# Altium schematic sheet 8x8.SchDoc
size 513 x 571 mm
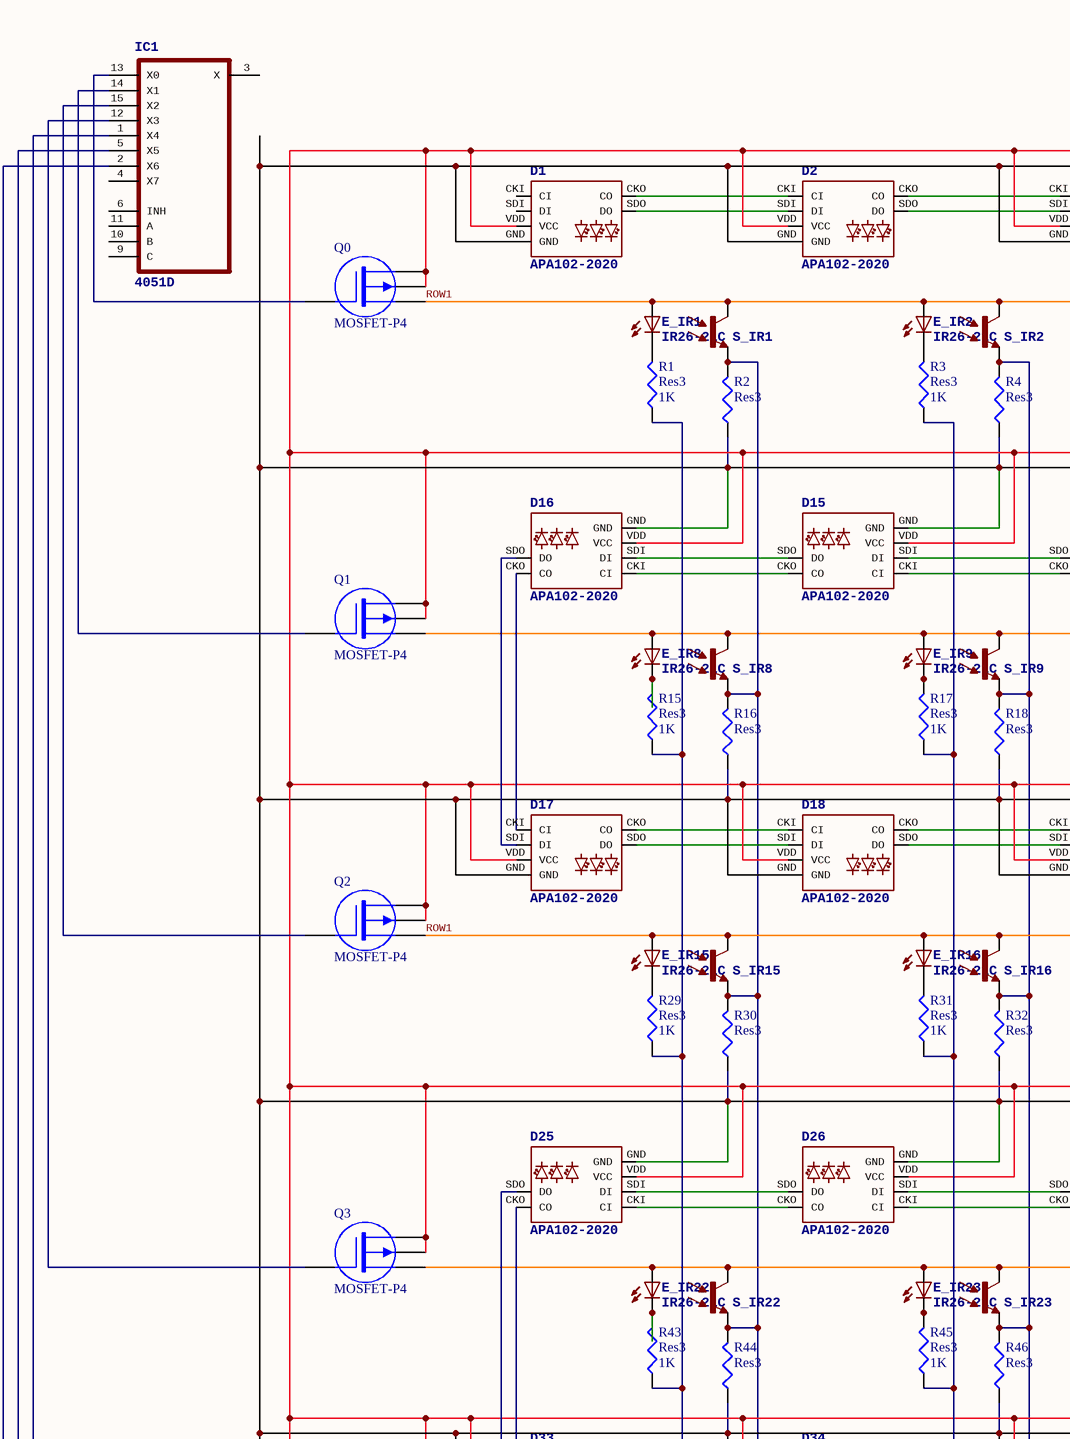
[diagram p0: 8x8.SchDoc, top left]
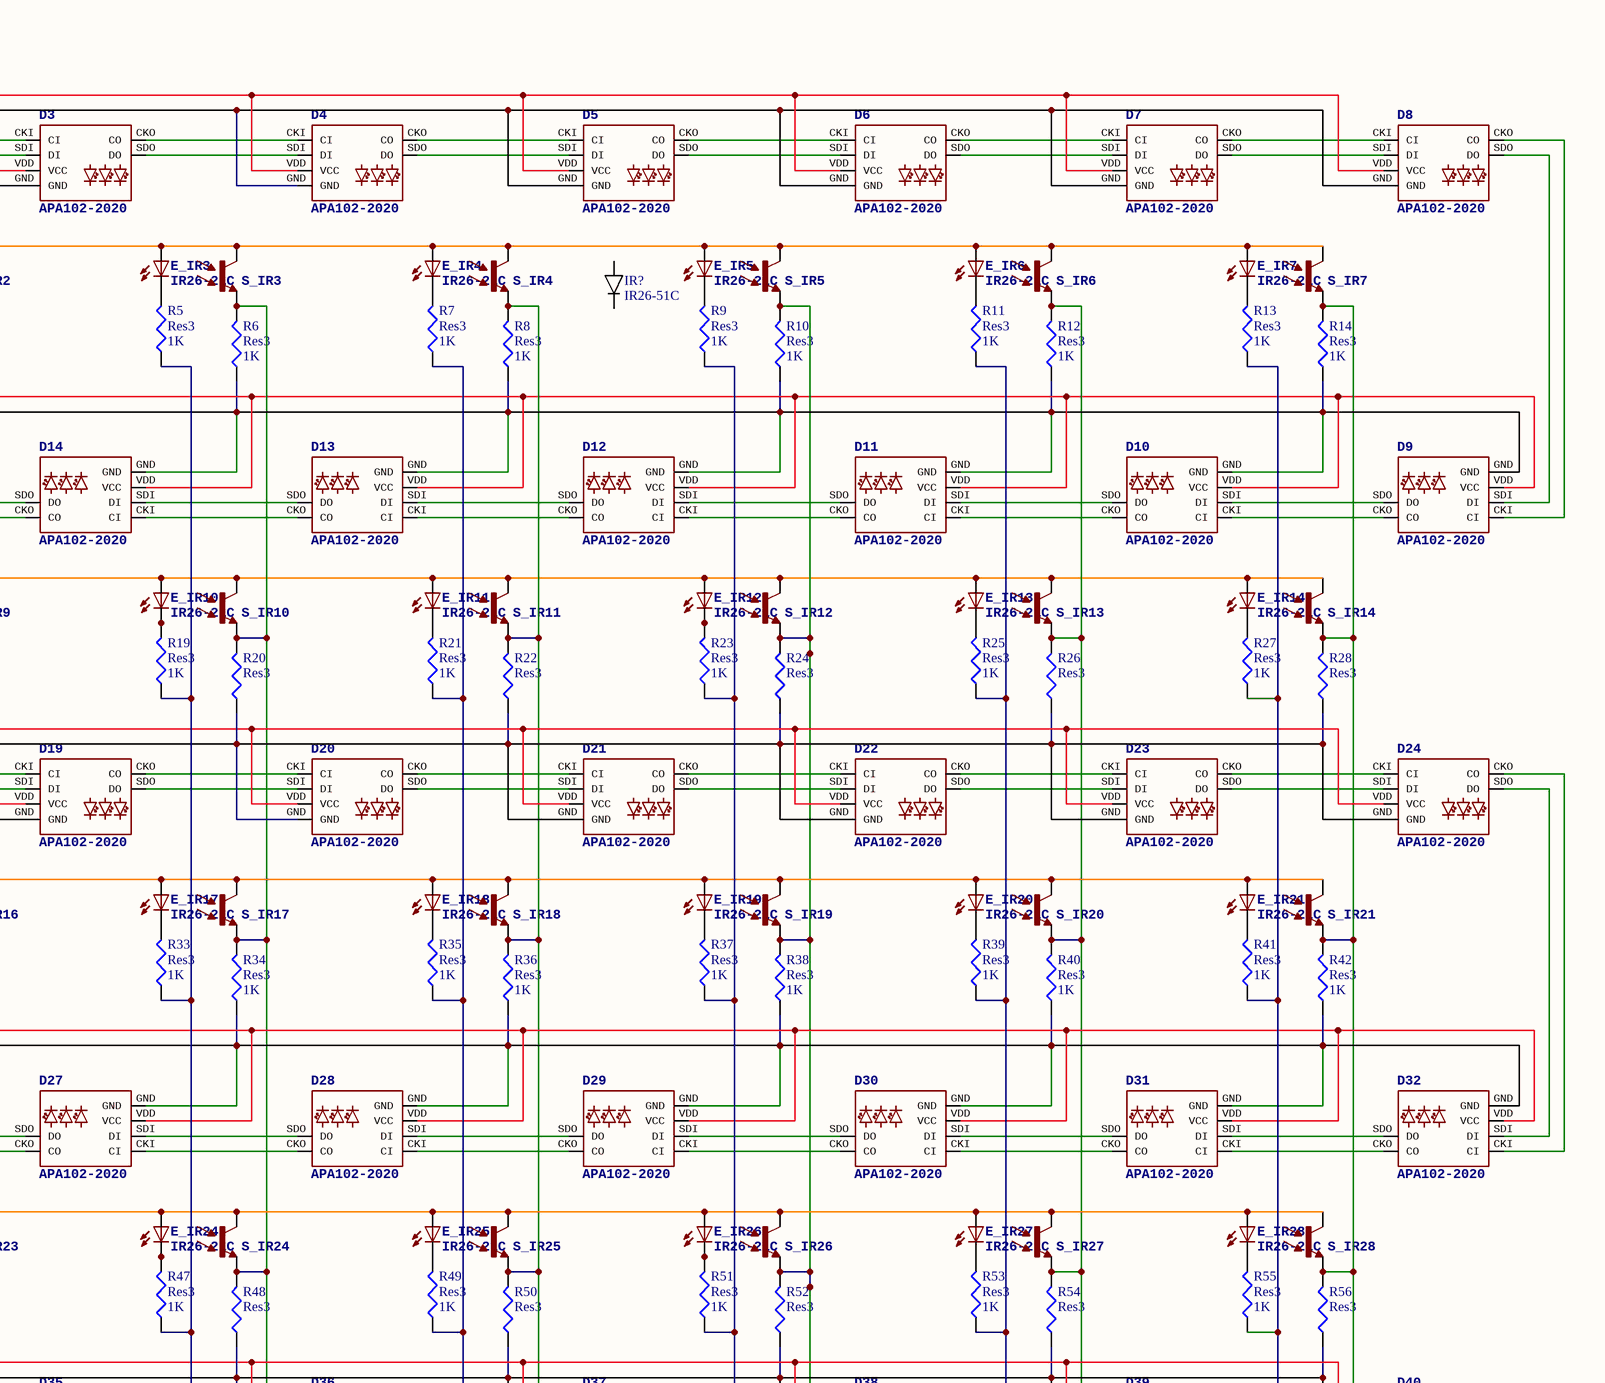
[diagram p1: 8x8.SchDoc, top right]
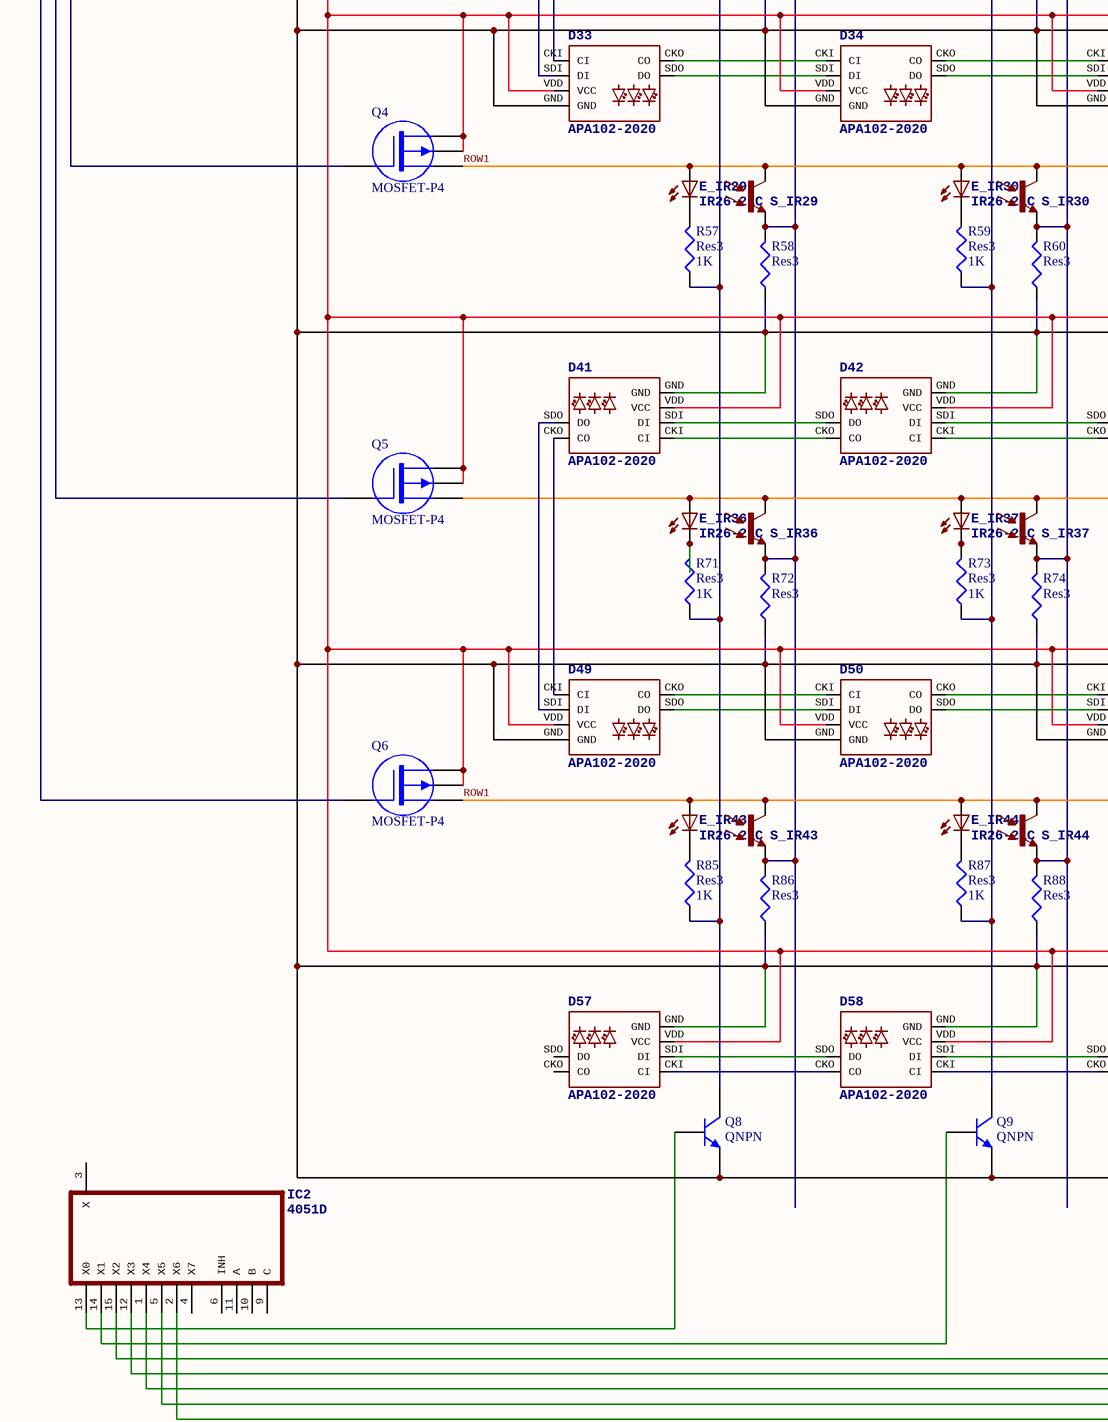
[diagram p2: 8x8.SchDoc, bottom left]
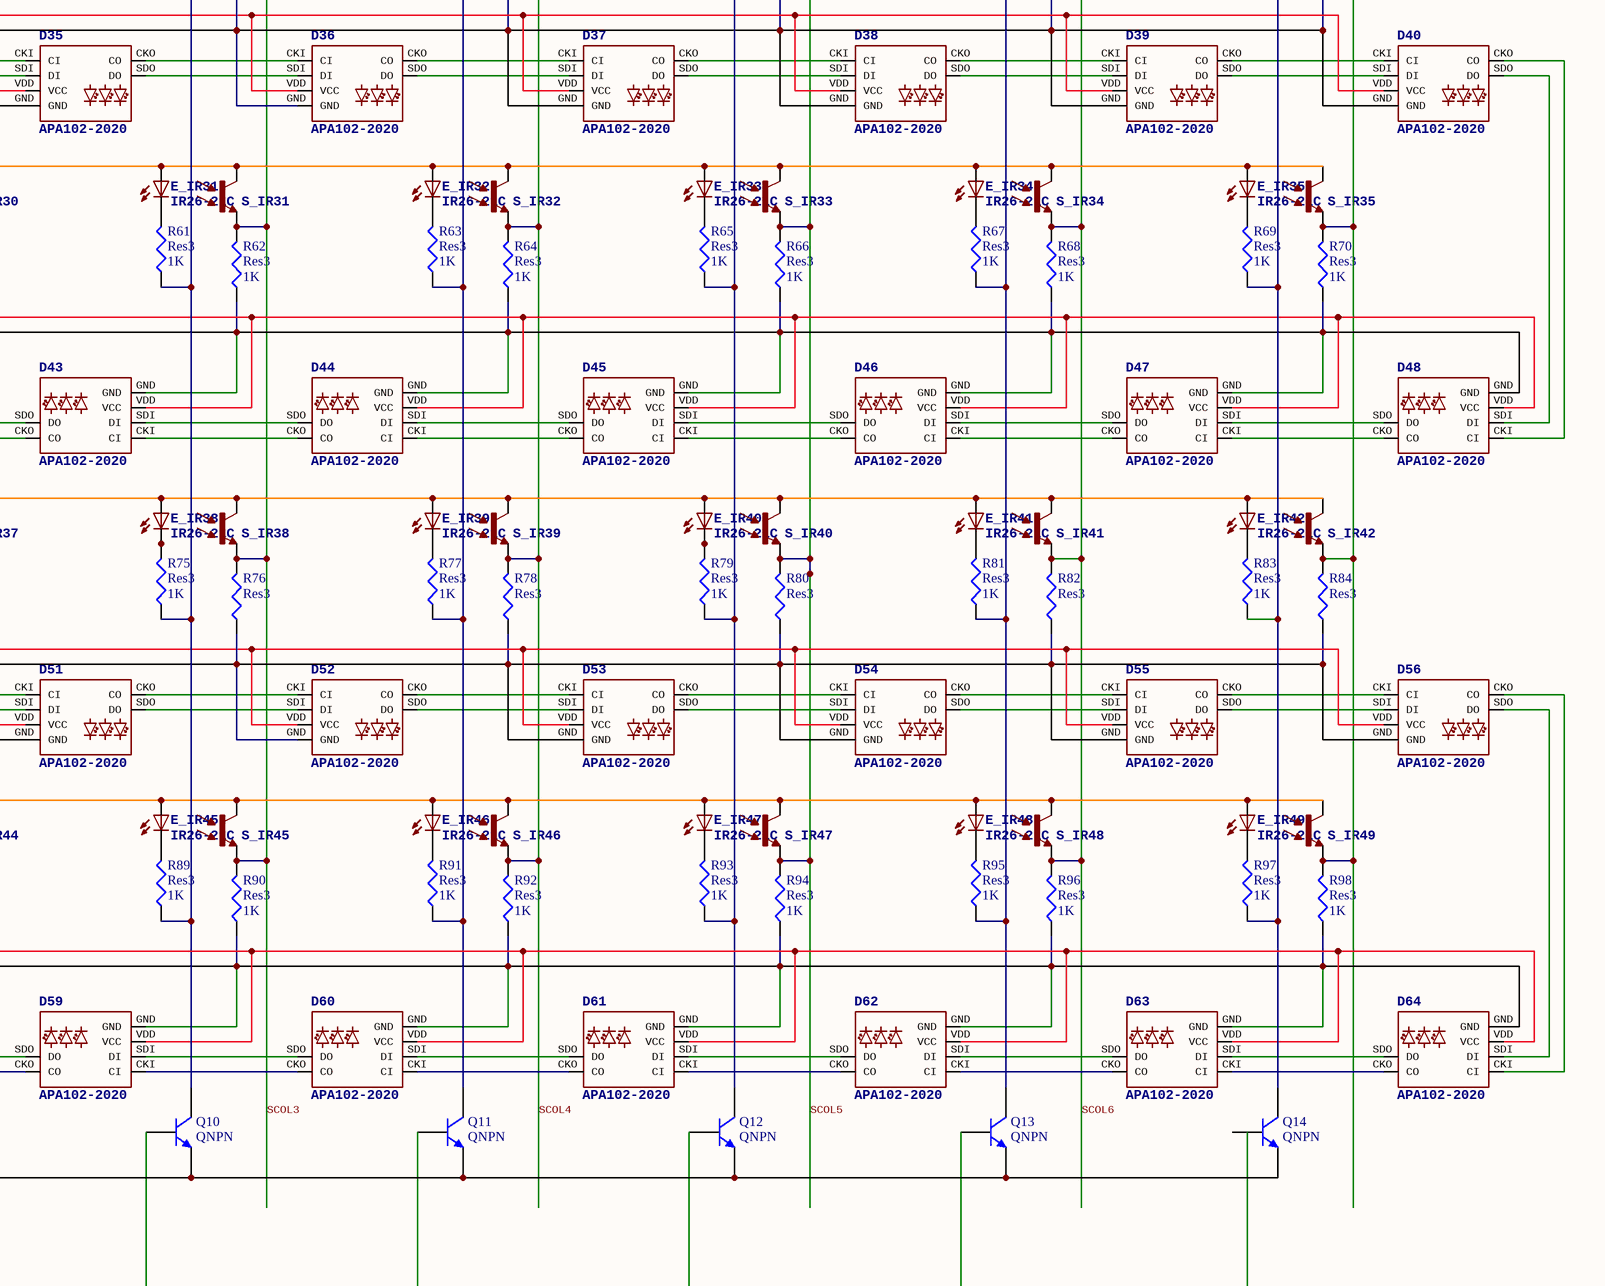
[diagram p3: 8x8.SchDoc, bottom right]

## Parts
D1  APA102-2020  [APA102-2020]
D2  APA102-2020  [APA102-2020]
D3  APA102-2020  [APA102-2020]
D4  APA102-2020  [APA102-2020]
D5  APA102-2020  [APA102-2020]
D6  APA102-2020  [APA102-2020]
D7  APA102-2020  [APA102-2020]
D8  APA102-2020  [APA102-2020]
D9  APA102-2020  [APA102-2020]
D10  APA102-2020  [APA102-2020]
D11  APA102-2020  [APA102-2020]
D12  APA102-2020  [APA102-2020]
D13  APA102-2020  [APA102-2020]
D14  APA102-2020  [APA102-2020]
D15  APA102-2020  [APA102-2020]
D16  APA102-2020  [APA102-2020]
D17  APA102-2020  [APA102-2020]
D18  APA102-2020  [APA102-2020]
D19  APA102-2020  [APA102-2020]
D20  APA102-2020  [APA102-2020]
D21  APA102-2020  [APA102-2020]
D22  APA102-2020  [APA102-2020]
D23  APA102-2020  [APA102-2020]
D24  APA102-2020  [APA102-2020]
D25  APA102-2020  [APA102-2020]
D26  APA102-2020  [APA102-2020]
D27  APA102-2020  [APA102-2020]
D28  APA102-2020  [APA102-2020]
D29  APA102-2020  [APA102-2020]
D30  APA102-2020  [APA102-2020]
D31  APA102-2020  [APA102-2020]
D32  APA102-2020  [APA102-2020]
D33  APA102-2020  [APA102-2020]
D34  APA102-2020  [APA102-2020]
D35  APA102-2020  [APA102-2020]
D36  APA102-2020  [APA102-2020]
D37  APA102-2020  [APA102-2020]
D38  APA102-2020  [APA102-2020]
D39  APA102-2020  [APA102-2020]
D40  APA102-2020  [APA102-2020]
D41  APA102-2020  [APA102-2020]
D42  APA102-2020  [APA102-2020]
D43  APA102-2020  [APA102-2020]
D44  APA102-2020  [APA102-2020]
D45  APA102-2020  [APA102-2020]
D46  APA102-2020  [APA102-2020]
D47  APA102-2020  [APA102-2020]
D48  APA102-2020  [APA102-2020]
D49  APA102-2020  [APA102-2020]
D50  APA102-2020  [APA102-2020]
D51  APA102-2020  [APA102-2020]
D52  APA102-2020  [APA102-2020]
D53  APA102-2020  [APA102-2020]
D54  APA102-2020  [APA102-2020]
D55  APA102-2020  [APA102-2020]
D56  APA102-2020  [APA102-2020]
D57  APA102-2020  [APA102-2020]
D58  APA102-2020  [APA102-2020]
D59  APA102-2020  [APA102-2020]
D60  APA102-2020  [APA102-2020]
D61  APA102-2020  [APA102-2020]
D62  APA102-2020  [APA102-2020]
D63  APA102-2020  [APA102-2020]
D64  APA102-2020  [APA102-2020]
E_IR1  IR26-21C  [E_IR]
E_IR2  IR26-21C  [E_IR]
E_IR3  IR26-21C  [E_IR]
E_IR4  IR26-21C  [E_IR]
E_IR5  IR26-21C  [E_IR]
E_IR6  IR26-21C  [E_IR]
E_IR7  IR26-21C  [E_IR]
E_IR8  IR26-21C  [E_IR]
E_IR9  IR26-21C  [E_IR]
E_IR10  IR26-21C  [E_IR]
E_IR11  IR26-21C  [E_IR]
E_IR12  IR26-21C  [E_IR]
E_IR13  IR26-21C  [E_IR]
E_IR14  IR26-21C  [E_IR]
E_IR15  IR26-21C  [E_IR]
E_IR16  IR26-21C  [E_IR]
E_IR17  IR26-21C  [E_IR]
E_IR18  IR26-21C  [E_IR]
E_IR19  IR26-21C  [E_IR]
E_IR20  IR26-21C  [E_IR]
E_IR21  IR26-21C  [E_IR]
E_IR22  IR26-21C  [E_IR]
E_IR23  IR26-21C  [E_IR]
E_IR24  IR26-21C  [E_IR]
E_IR25  IR26-21C  [E_IR]
E_IR26  IR26-21C  [E_IR]
E_IR27  IR26-21C  [E_IR]
E_IR28  IR26-21C  [E_IR]
E_IR29  IR26-21C  [E_IR]
E_IR30  IR26-21C  [E_IR]
E_IR31  IR26-21C  [E_IR]
E_IR32  IR26-21C  [E_IR]
E_IR33  IR26-21C  [E_IR]
E_IR34  IR26-21C  [E_IR]
E_IR35  IR26-21C  [E_IR]
E_IR36  IR26-21C  [E_IR]
E_IR37  IR26-21C  [E_IR]
E_IR38  IR26-21C  [E_IR]
E_IR39  IR26-21C  [E_IR]
E_IR40  IR26-21C  [E_IR]
E_IR41  IR26-21C  [E_IR]
E_IR42  IR26-21C  [E_IR]
E_IR43  IR26-21C  [E_IR]
E_IR44  IR26-21C  [E_IR]
E_IR45  IR26-21C  [E_IR]
E_IR46  IR26-21C  [E_IR]
E_IR47  IR26-21C  [E_IR]
E_IR48  IR26-21C  [E_IR]
E_IR49  IR26-21C  [E_IR]
IC1  4051D  [SO16]
IC2  4051D  [SO16]
IR?  IR26-51C  [IR26_51C]
Q0  MOSFET-P4  [SOT223_N]
Q1  MOSFET-P4  [SOT223_N]
Q2  MOSFET-P4  [SOT223_N]
Q3  MOSFET-P4  [SOT223_N]
Q4  MOSFET-P4  [SOT223_N]
Q5  MOSFET-P4  [SOT223_N]
Q6  MOSFET-P4  [SOT223_N]
Q8  QNPN  [SOT-23B_N]
Q9  QNPN  [SOT-23B_N]
Q10  QNPN  [SOT-23B_N]
Q11  QNPN  [SOT-23B_N]
Q12  QNPN  [SOT-23B_N]
Q13  QNPN  [SOT-23B_N]
Q14  QNPN  [SOT-23B_N]
R1  Res3  value 1K  [J1-0603]
R2  Res3  [J1-0603]
R3  Res3  value 1K  [J1-0603]
R4  Res3  [J1-0603]
R5  Res3  value 1K  [J1-0603]
R6  Res3  value 1K  [J1-0603]
R7  Res3  value 1K  [J1-0603]
R8  Res3  value 1K  [J1-0603]
R9  Res3  value 1K  [J1-0603]
R10  Res3  value 1K  [J1-0603]
R11  Res3  value 1K  [J1-0603]
R12  Res3  value 1K  [J1-0603]
R13  Res3  value 1K  [J1-0603]
R14  Res3  value 1K  [J1-0603]
R15  Res3  value 1K  [J1-0603]
R16  Res3  [J1-0603]
R17  Res3  value 1K  [J1-0603]
R18  Res3  [J1-0603]
R19  Res3  value 1K  [J1-0603]
R20  Res3  [J1-0603]
R21  Res3  value 1K  [J1-0603]
R22  Res3  [J1-0603]
R23  Res3  value 1K  [J1-0603]
R24  Res3  [J1-0603]
R25  Res3  value 1K  [J1-0603]
R26  Res3  [J1-0603]
R27  Res3  value 1K  [J1-0603]
R28  Res3  [J1-0603]
R29  Res3  value 1K  [J1-0603]
R30  Res3  [J1-0603]
R31  Res3  value 1K  [J1-0603]
R32  Res3  [J1-0603]
R33  Res3  value 1K  [J1-0603]
R34  Res3  value 1K  [J1-0603]
R35  Res3  value 1K  [J1-0603]
R36  Res3  value 1K  [J1-0603]
R37  Res3  value 1K  [J1-0603]
R38  Res3  value 1K  [J1-0603]
R39  Res3  value 1K  [J1-0603]
R40  Res3  value 1K  [J1-0603]
R41  Res3  value 1K  [J1-0603]
R42  Res3  value 1K  [J1-0603]
R43  Res3  value 1K  [J1-0603]
R44  Res3  [J1-0603]
R45  Res3  value 1K  [J1-0603]
R46  Res3  [J1-0603]
R47  Res3  value 1K  [J1-0603]
R48  Res3  [J1-0603]
R49  Res3  value 1K  [J1-0603]
R50  Res3  [J1-0603]
R51  Res3  value 1K  [J1-0603]
R52  Res3  [J1-0603]
R53  Res3  value 1K  [J1-0603]
R54  Res3  [J1-0603]
R55  Res3  value 1K  [J1-0603]
R56  Res3  [J1-0603]
R57  Res3  value 1K  [J1-0603]
R58  Res3  [J1-0603]
R59  Res3  value 1K  [J1-0603]
R60  Res3  [J1-0603]
R61  Res3  value 1K  [J1-0603]
R62  Res3  value 1K  [J1-0603]
R63  Res3  value 1K  [J1-0603]
R64  Res3  value 1K  [J1-0603]
R65  Res3  value 1K  [J1-0603]
R66  Res3  value 1K  [J1-0603]
R67  Res3  value 1K  [J1-0603]
R68  Res3  value 1K  [J1-0603]
R69  Res3  value 1K  [J1-0603]
R70  Res3  value 1K  [J1-0603]
R71  Res3  value 1K  [J1-0603]
R72  Res3  [J1-0603]
R73  Res3  value 1K  [J1-0603]
R74  Res3  [J1-0603]
R75  Res3  value 1K  [J1-0603]
R76  Res3  [J1-0603]
R77  Res3  value 1K  [J1-0603]
R78  Res3  [J1-0603]
R79  Res3  value 1K  [J1-0603]
R80  Res3  [J1-0603]
R81  Res3  value 1K  [J1-0603]
R82  Res3  [J1-0603]
R83  Res3  value 1K  [J1-0603]
R84  Res3  [J1-0603]
R85  Res3  value 1K  [J1-0603]
R86  Res3  [J1-0603]
R87  Res3  value 1K  [J1-0603]
R88  Res3  [J1-0603]
R89  Res3  value 1K  [J1-0603]
R90  Res3  value 1K  [J1-0603]
R91  Res3  value 1K  [J1-0603]
R92  Res3  value 1K  [J1-0603]
R93  Res3  value 1K  [J1-0603]
R94  Res3  value 1K  [J1-0603]
R95  Res3  value 1K  [J1-0603]
R96  Res3  value 1K  [J1-0603]
R97  Res3  value 1K  [J1-0603]
R98  Res3  value 1K  [J1-0603]
S_IR1  PT15-21B  [S_IR]  (value not drawn)
S_IR2  PT15-21B  [S_IR]  (value not drawn)
S_IR3  PT15-21B  [S_IR]  (value not drawn)
S_IR4  PT15-21B  [S_IR]  (value not drawn)
S_IR5  PT15-21B  [S_IR]  (value not drawn)
S_IR6  PT15-21B  [S_IR]  (value not drawn)
S_IR7  PT15-21B  [S_IR]  (value not drawn)
S_IR8  PT15-21B  [S_IR]  (value not drawn)
S_IR9  PT15-21B  [S_IR]  (value not drawn)
S_IR10  PT15-21B  [S_IR]  (value not drawn)
S_IR11  PT15-21B  [S_IR]  (value not drawn)
S_IR12  PT15-21B  [S_IR]  (value not drawn)
S_IR13  PT15-21B  [S_IR]  (value not drawn)
S_IR14  PT15-21B  [S_IR]  (value not drawn)
S_IR15  PT15-21B  [S_IR]  (value not drawn)
S_IR16  PT15-21B  [S_IR]  (value not drawn)
S_IR17  PT15-21B  [S_IR]  (value not drawn)
S_IR18  PT15-21B  [S_IR]  (value not drawn)
S_IR19  PT15-21B  [S_IR]  (value not drawn)
S_IR20  PT15-21B  [S_IR]  (value not drawn)
S_IR21  PT15-21B  [S_IR]  (value not drawn)
S_IR22  PT15-21B  [S_IR]  (value not drawn)
S_IR23  PT15-21B  [S_IR]  (value not drawn)
S_IR24  PT15-21B  [S_IR]  (value not drawn)
S_IR25  PT15-21B  [S_IR]  (value not drawn)
S_IR26  PT15-21B  [S_IR]  (value not drawn)
S_IR27  PT15-21B  [S_IR]  (value not drawn)
S_IR28  PT15-21B  [S_IR]  (value not drawn)
S_IR29  PT15-21B  [S_IR]  (value not drawn)
S_IR30  PT15-21B  [S_IR]  (value not drawn)
S_IR31  PT15-21B  [S_IR]  (value not drawn)
S_IR32  PT15-21B  [S_IR]  (value not drawn)
S_IR33  PT15-21B  [S_IR]  (value not drawn)
S_IR34  PT15-21B  [S_IR]  (value not drawn)
S_IR35  PT15-21B  [S_IR]  (value not drawn)
S_IR36  PT15-21B  [S_IR]  (value not drawn)
S_IR37  PT15-21B  [S_IR]  (value not drawn)
S_IR38  PT15-21B  [S_IR]  (value not drawn)
S_IR39  PT15-21B  [S_IR]  (value not drawn)
S_IR40  PT15-21B  [S_IR]  (value not drawn)
S_IR41  PT15-21B  [S_IR]  (value not drawn)
S_IR42  PT15-21B  [S_IR]  (value not drawn)
S_IR43  PT15-21B  [S_IR]  (value not drawn)
S_IR44  PT15-21B  [S_IR]  (value not drawn)
S_IR45  PT15-21B  [S_IR]  (value not drawn)
S_IR46  PT15-21B  [S_IR]  (value not drawn)
S_IR47  PT15-21B  [S_IR]  (value not drawn)
S_IR48  PT15-21B  [S_IR]  (value not drawn)
S_IR49  PT15-21B  [S_IR]  (value not drawn)

## Nets
ROW1: E_IR1.2(A) E_IR2.2(A) E_IR3.2(A) E_IR4.2(A) E_IR5.2(A) E_IR6.2(A) E_IR7.2(A) E_IR15.2(A) E_IR16.2(A) E_IR17.2(A) E_IR18.2(A) E_IR19.2(A) E_IR20.2(A) E_IR21.2(A) E_IR29.2(A) E_IR30.2(A) E_IR31.2(A) E_IR32.2(A) E_IR33.2(A) E_IR34.2(A) E_IR35.2(A) E_IR43.2(A) E_IR44.2(A) E_IR45.2(A) E_IR46.2(A) E_IR47.2(A) E_IR48.2(A) E_IR49.2(A) Q0.4(S) Q2.4(S) Q4.4(S) Q6.4(S) S_IR1.2(2C) S_IR2.2(2C) S_IR3.2(2C) S_IR4.2(2C) S_IR5.2(2C) S_IR6.2(2C) S_IR7.2(2C) S_IR15.2(2C) S_IR16.2(2C) S_IR17.2(2C) S_IR18.2(2C) S_IR19.2(2C) S_IR20.2(2C) S_IR21.2(2C) S_IR29.2(2C) S_IR30.2(2C) S_IR31.2(2C) S_IR32.2(2C) S_IR33.2(2C) S_IR34.2(2C) S_IR35.2(2C) S_IR43.2(2C) S_IR44.2(2C) S_IR45.2(2C) S_IR46.2(2C) S_IR47.2(2C) S_IR48.2(2C) S_IR49.2(2C)
SCOL3: R6.2 R20.2 R34.2 R48.2 R62.2 R76.2 R90.2 S_IR3.1(1E) S_IR10.1(1E) S_IR17.1(1E) S_IR24.1(1E) S_IR31.1(1E) S_IR38.1(1E) S_IR45.1(1E)
SCOL4: R8.2 R22.2 R36.2 R50.2 R64.2 R78.2 R92.2 S_IR4.1(1E) S_IR11.1(1E) S_IR18.1(1E) S_IR25.1(1E) S_IR32.1(1E) S_IR39.1(1E) S_IR46.1(1E)
SCOL5: R10.2 R24.2 R38.2 R52.2 R66.2 R80.2 R94.2 S_IR5.1(1E) S_IR12.1(1E) S_IR19.1(1E) S_IR26.1(1E) S_IR33.1(1E) S_IR40.1(1E) S_IR47.1(1E)
SCOL6: R12.2 R26.2 R40.2 R54.2 R68.2 R82.2 R96.2 S_IR6.1(1E) S_IR13.1(1E) S_IR20.1(1E) S_IR27.1(1E) S_IR34.1(1E) S_IR41.1(1E) S_IR48.1(1E)
NetD1_CKO: D1.CKO(CO) D2.CKI(CI)
NetD1_GND: D1.GND D2.GND D3.GND D4.GND D5.GND D6.GND D7.GND D8.GND D9.GND D10.GND D11.GND D12.GND D13.GND D14.GND D15.GND D16.GND D17.GND D18.GND D19.GND D20.GND D21.GND D22.GND D23.GND D24.GND D25.GND D26.GND D27.GND D28.GND D29.GND D30.GND D31.GND D32.GND D33.GND D34.GND D35.GND D36.GND D37.GND D38.GND D39.GND D40.GND D41.GND D42.GND D43.GND D44.GND D45.GND D46.GND D47.GND D48.GND D49.GND D50.GND D51.GND D52.GND D53.GND D54.GND D55.GND D56.GND D57.GND D58.GND D59.GND D60.GND D61.GND D62.GND D63.GND D64.GND Q8.3(E) Q9.3(E) Q10.3(E) Q11.3(E) Q12.3(E) Q13.3(E) Q14.3(E) R2.1 R4.1 R6.1 R8.1 R10.1 R12.1 R14.1 R16.1 R18.1 R20.1 R22.1 R24.1 R26.1 R28.1 R30.1 R32.1 R34.1 R36.1 R38.1 R40.1 R42.1 R44.1 R46.1 R48.1 R50.1 R52.1 R54.1 R56.1 R58.1 R60.1 R62.1 R64.1 R66.1 R68.1 R70.1 R72.1 R74.1 R76.1 R78.1 R80.1 R82.1 R84.1 R86.1 R88.1 R90.1 R92.1 R94.1 R96.1 R98.1
NetD1_SDO: D1.SDO(DO) D2.SDI(DI)
NetD1_VDD: D1.VDD(VCC) D2.VDD(VCC) D3.VDD(VCC) D4.VDD(VCC) D5.VDD(VCC) D6.VDD(VCC) D7.VDD(VCC) D8.VDD(VCC) D9.VDD(VCC) D10.VDD(VCC) D11.VDD(VCC) D12.VDD(VCC) D13.VDD(VCC) D14.VDD(VCC) D15.VDD(VCC) D16.VDD(VCC) D17.VDD(VCC) D18.VDD(VCC) D19.VDD(VCC) D20.VDD(VCC) D21.VDD(VCC) D22.VDD(VCC) D23.VDD(VCC) D24.VDD(VCC) D25.VDD(VCC) D26.VDD(VCC) D27.VDD(VCC) D28.VDD(VCC) D29.VDD(VCC) D30.VDD(VCC) D31.VDD(VCC) D32.VDD(VCC) D33.VDD(VCC) D34.VDD(VCC) D35.VDD(VCC) D36.VDD(VCC) D37.VDD(VCC) D38.VDD(VCC) D39.VDD(VCC) D40.VDD(VCC) D41.VDD(VCC) D42.VDD(VCC) D43.VDD(VCC) D44.VDD(VCC) D45.VDD(VCC) D46.VDD(VCC) D47.VDD(VCC) D48.VDD(VCC) D49.VDD(VCC) D50.VDD(VCC) D51.VDD(VCC) D52.VDD(VCC) D53.VDD(VCC) D54.VDD(VCC) D55.VDD(VCC) D56.VDD(VCC) D57.VDD(VCC) D58.VDD(VCC) D59.VDD(VCC) D60.VDD(VCC) D61.VDD(VCC) D62.VDD(VCC) D63.VDD(VCC) D64.VDD(VCC) Q0.2(D) Q0.3(U) Q1.2(D) Q1.3(U) Q2.2(D) Q2.3(U) Q3.2(D) Q3.3(U) Q4.2(D) Q4.3(U) Q5.2(D) Q5.3(U) Q6.2(D) Q6.3(U)
NetD2_CKO: D2.CKO(CO) D3.CKI(CI)
NetD2_SDO: D2.SDO(DO) D3.SDI(DI)
NetD3_CKO: D3.CKO(CO) D4.CKI(CI)
NetD3_SDO: D3.SDO(DO) D4.SDI(DI)
NetD4_CKO: D4.CKO(CO) D5.CKI(CI)
NetD4_SDO: D4.SDO(DO) D5.SDI(DI)
NetD5_CKO: D5.CKO(CO) D6.CKI(CI)
NetD5_SDO: D5.SDO(DO) D6.SDI(DI)
NetD6_CKO: D6.CKO(CO) D7.CKI(CI)
NetD6_SDO: D6.SDO(DO) D7.SDI(DI)
NetD7_CKO: D7.CKO(CO) D8.CKI(CI)
NetD7_SDO: D7.SDO(DO) D8.SDI(DI)
NetD8_CKO: D8.CKO(CO) D9.CKI(CI)
NetD8_SDO: D8.SDO(DO) D9.SDI(DI)
NetD9_CKO: D9.CKO(CO) D10.CKI(CI)
NetD9_SDO: D9.SDO(DO) D10.SDI(DI)
NetD10_CKO: D10.CKO(CO) D11.CKI(CI)
NetD10_SDO: D10.SDO(DO) D11.SDI(DI)
NetD11_CKO: D11.CKO(CO) D12.CKI(CI)
NetD11_SDO: D11.SDO(DO) D12.SDI(DI)
NetD12_CKO: D12.CKO(CO) D13.CKI(CI)
NetD12_SDO: D12.SDO(DO) D13.SDI(DI)
NetD13_CKO: D13.CKO(CO) D14.CKI(CI)
NetD13_SDO: D13.SDO(DO) D14.SDI(DI)
NetD14_CKO: D14.CKO(CO) D15.CKI(CI)
NetD14_SDO: D14.SDO(DO) D15.SDI(DI)
NetD15_CKO: D15.CKO(CO) D16.CKI(CI)
NetD15_SDO: D15.SDO(DO) D16.SDI(DI)
NetD16_CKO: D16.CKO(CO) D17.CKI(CI)
NetD16_SDO: D16.SDO(DO) D17.SDI(DI)
NetD17_CKO: D17.CKO(CO) D18.CKI(CI)
NetD17_SDO: D17.SDO(DO) D18.SDI(DI)
NetD18_CKO: D18.CKO(CO) D19.CKI(CI)
NetD18_SDO: D18.SDO(DO) D19.SDI(DI)
NetD19_CKO: D19.CKO(CO) D20.CKI(CI)
NetD19_SDO: D19.SDO(DO) D20.SDI(DI)
NetD20_CKO: D20.CKO(CO) D21.CKI(CI)
NetD20_SDO: D20.SDO(DO) D21.SDI(DI)
NetD21_CKO: D21.CKO(CO) D22.CKI(CI)
NetD21_SDO: D21.SDO(DO) D22.SDI(DI)
NetD22_CKO: D22.CKO(CO) D23.CKI(CI)
NetD22_SDO: D22.SDO(DO) D23.SDI(DI)
NetD23_CKO: D23.CKO(CO) D24.CKI(CI)
NetD23_SDO: D23.SDO(DO) D24.SDI(DI)
NetD24_CKO: D24.CKO(CO) D32.CKI(CI)
NetD24_SDO: D24.SDO(DO) D32.SDI(DI)
NetD25_CKI: D25.CKI(CI) D26.CKO(CO)
NetD25_CKO: D25.CKO(CO) D33.CKI(CI)
NetD25_SDI: D25.SDI(DI) D26.SDO(DO)
NetD25_SDO: D25.SDO(DO) D33.SDI(DI)
NetD26_CKI: D26.CKI(CI) D27.CKO(CO)
NetD26_SDI: D26.SDI(DI) D27.SDO(DO)
NetD27_CKI: D27.CKI(CI) D28.CKO(CO)
NetD27_SDI: D27.SDI(DI) D28.SDO(DO)
NetD28_CKI: D28.CKI(CI) D29.CKO(CO)
NetD28_SDI: D28.SDI(DI) D29.SDO(DO)
NetD29_CKI: D29.CKI(CI) D30.CKO(CO)
NetD29_SDI: D29.SDI(DI) D30.SDO(DO)
NetD30_CKI: D30.CKI(CI) D31.CKO(CO)
NetD30_SDI: D30.SDI(DI) D31.SDO(DO)
NetD31_CKI: D31.CKI(CI) D32.CKO(CO)
NetD31_SDI: D31.SDI(DI) D32.SDO(DO)
NetD33_CKO: D33.CKO(CO) D34.CKI(CI)
NetD33_SDO: D33.SDO(DO) D34.SDI(DI)
NetD34_CKO: D34.CKO(CO) D35.CKI(CI)
NetD34_SDO: D34.SDO(DO) D35.SDI(DI)
NetD35_CKO: D35.CKO(CO) D36.CKI(CI)
NetD35_SDO: D35.SDO(DO) D36.SDI(DI)
NetD36_CKO: D36.CKO(CO) D37.CKI(CI)
NetD36_SDO: D36.SDO(DO) D37.SDI(DI)
NetD37_CKO: D37.CKO(CO) D38.CKI(CI)
NetD37_SDO: D37.SDO(DO) D38.SDI(DI)
NetD38_CKO: D38.CKO(CO) D39.CKI(CI)
NetD38_SDO: D38.SDO(DO) D39.SDI(DI)
NetD39_CKO: D39.CKO(CO) D40.CKI(CI)
NetD39_SDO: D39.SDO(DO) D40.SDI(DI)
NetD40_CKO: D40.CKO(CO) D48.CKI(CI)
NetD40_SDO: D40.SDO(DO) D48.SDI(DI)
NetD41_CKI: D41.CKI(CI) D42.CKO(CO)
NetD41_CKO: D41.CKO(CO) D49.CKI(CI)
NetD41_SDI: D41.SDI(DI) D42.SDO(DO)
NetD41_SDO: D41.SDO(DO) D49.SDI(DI)
NetD42_CKI: D42.CKI(CI) D43.CKO(CO)
NetD42_SDI: D42.SDI(DI) D43.SDO(DO)
NetD43_CKI: D43.CKI(CI) D44.CKO(CO)
NetD43_SDI: D43.SDI(DI) D44.SDO(DO)
NetD44_CKI: D44.CKI(CI) D45.CKO(CO)
NetD44_SDI: D44.SDI(DI) D45.SDO(DO)
NetD45_CKI: D45.CKI(CI) D46.CKO(CO)
NetD45_SDI: D45.SDI(DI) D46.SDO(DO)
NetD46_CKI: D46.CKI(CI) D47.CKO(CO)
NetD46_SDI: D46.SDI(DI) D47.SDO(DO)
NetD47_CKI: D47.CKI(CI) D48.CKO(CO)
NetD47_SDI: D47.SDI(DI) D48.SDO(DO)
NetD49_CKO: D49.CKO(CO) D50.CKI(CI)
NetD49_SDO: D49.SDO(DO) D50.SDI(DI)
NetD50_CKO: D50.CKO(CO) D51.CKI(CI)
NetD50_SDO: D50.SDO(DO) D51.SDI(DI)
NetD51_CKO: D51.CKO(CO) D52.CKI(CI)
NetD51_SDO: D51.SDO(DO) D52.SDI(DI)
NetD52_CKO: D52.CKO(CO) D53.CKI(CI)
NetD52_SDO: D52.SDO(DO) D53.SDI(DI)
NetD53_CKO: D53.CKO(CO) D54.CKI(CI)
NetD53_SDO: D53.SDO(DO) D54.SDI(DI)
NetD54_CKO: D54.CKO(CO) D55.CKI(CI)
NetD54_SDO: D54.SDO(DO) D55.SDI(DI)
NetD55_CKO: D55.CKO(CO) D56.CKI(CI)
NetD55_SDO: D55.SDO(DO) D56.SDI(DI)
NetD56_CKO: D56.CKO(CO) D64.CKI(CI)
NetD56_SDO: D56.SDO(DO) D64.SDI(DI)
NetD57_CKI: D57.CKI(CI) D58.CKO(CO)
NetD57_SDI: D57.SDI(DI) D58.SDO(DO)
NetD58_CKI: D58.CKI(CI) D59.CKO(CO)
NetD58_SDI: D58.SDI(DI) D59.SDO(DO)
NetD59_CKI: D59.CKI(CI) D60.CKO(CO)
NetD59_SDI: D59.SDI(DI) D60.SDO(DO)
NetD60_CKI: D60.CKI(CI) D61.CKO(CO)
NetD60_SDI: D60.SDI(DI) D61.SDO(DO)
NetD61_CKI: D61.CKI(CI) D62.CKO(CO)
NetD61_SDI: D61.SDI(DI) D62.SDO(DO)
NetD62_CKI: D62.CKI(CI) D63.CKO(CO)
NetD62_SDI: D62.SDI(DI) D63.SDO(DO)
NetD63_CKI: D63.CKI(CI) D64.CKO(CO)
NetD63_SDI: D63.SDI(DI) D64.SDO(DO)
NetE_IR1_1: E_IR1.1(C) R1.2
NetE_IR2_1: E_IR2.1(C) R3.2
NetE_IR3_1: E_IR3.1(C) R5.2
NetE_IR4_1: E_IR4.1(C) R7.2
NetE_IR5_1: E_IR5.1(C) R9.2
NetE_IR6_1: E_IR6.1(C) R11.2
NetE_IR7_1: E_IR7.1(C) R13.2
NetE_IR8_1: E_IR8.1(C) R15.2
NetE_IR8_2: E_IR8.2(A) E_IR9.2(A) E_IR10.2(A) E_IR11.2(A) E_IR12.2(A) E_IR13.2(A) E_IR14.2(A) Q1.4(S) S_IR8.2(2C) S_IR9.2(2C) S_IR10.2(2C) S_IR11.2(2C) S_IR12.2(2C) S_IR13.2(2C) S_IR14.2(2C)
NetE_IR9_1: E_IR9.1(C) R17.2
NetE_IR10_1: E_IR10.1(C) R19.2
NetE_IR11_1: E_IR11.1(C) R21.2
NetE_IR12_1: E_IR12.1(C) R23.2
NetE_IR13_1: E_IR13.1(C) R25.2
NetE_IR14_1: E_IR14.1(C) R27.2
NetE_IR15_1: E_IR15.1(C) R29.2
NetE_IR16_1: E_IR16.1(C) R31.2
NetE_IR17_1: E_IR17.1(C) R33.2
NetE_IR18_1: E_IR18.1(C) R35.2
NetE_IR19_1: E_IR19.1(C) R37.2
NetE_IR20_1: E_IR20.1(C) R39.2
NetE_IR21_1: E_IR21.1(C) R41.2
NetE_IR22_1: E_IR22.1(C) R43.2
NetE_IR22_2: E_IR22.2(A) E_IR23.2(A) E_IR24.2(A) E_IR25.2(A) E_IR26.2(A) E_IR27.2(A) E_IR28.2(A) Q3.4(S) S_IR22.2(2C) S_IR23.2(2C) S_IR24.2(2C) S_IR25.2(2C) S_IR26.2(2C) S_IR27.2(2C) S_IR28.2(2C)
NetE_IR23_1: E_IR23.1(C) R45.2
NetE_IR24_1: E_IR24.1(C) R47.2
NetE_IR25_1: E_IR25.1(C) R49.2
NetE_IR26_1: E_IR26.1(C) R51.2
NetE_IR27_1: E_IR27.1(C) R53.2
NetE_IR28_1: E_IR28.1(C) R55.2
NetE_IR29_1: E_IR29.1(C) R57.2
NetE_IR30_1: E_IR30.1(C) R59.2
NetE_IR31_1: E_IR31.1(C) R61.2
NetE_IR32_1: E_IR32.1(C) R63.2
NetE_IR33_1: E_IR33.1(C) R65.2
NetE_IR34_1: E_IR34.1(C) R67.2
NetE_IR35_1: E_IR35.1(C) R69.2
NetE_IR36_1: E_IR36.1(C) R71.2
NetE_IR36_2: E_IR36.2(A) E_IR37.2(A) E_IR38.2(A) E_IR39.2(A) E_IR40.2(A) E_IR41.2(A) E_IR42.2(A) Q5.4(S) S_IR36.2(2C) S_IR37.2(2C) S_IR38.2(2C) S_IR39.2(2C) S_IR40.2(2C) S_IR41.2(2C) S_IR42.2(2C)
NetE_IR37_1: E_IR37.1(C) R73.2
NetE_IR38_1: E_IR38.1(C) R75.2
NetE_IR39_1: E_IR39.1(C) R77.2
NetE_IR40_1: E_IR40.1(C) R79.2
NetE_IR41_1: E_IR41.1(C) R81.2
NetE_IR42_1: E_IR42.1(C) R83.2
NetE_IR43_1: E_IR43.1(C) R85.2
NetE_IR44_1: E_IR44.1(C) R87.2
NetE_IR45_1: E_IR45.1(C) R89.2
NetE_IR46_1: E_IR46.1(C) R91.2
NetE_IR47_1: E_IR47.1(C) R93.2
NetE_IR48_1: E_IR48.1(C) R95.2
NetE_IR49_1: E_IR49.1(C) R97.2
NetIC1_1: IC1.1(X4) Q4.1(G)
NetIC1_2: IC1.2(X6) Q6.1(G)
NetIC1_5: IC1.5(X5) Q5.1(G)
NetIC1_12: IC1.12(X3) Q3.1(G)
NetIC1_13: IC1.13(X0) Q0.1(G)
NetIC1_14: IC1.14(X1) Q1.1(G)
NetIC1_15: IC1.15(X2) Q2.1(G)
NetIC2_1: IC2.1(X4) Q12.2(B)
NetIC2_5: IC2.5(X5) Q13.2(B)
NetIC2_12: IC2.12(X3) Q11.2(B)
NetIC2_13: IC2.13(X0) Q8.2(B)
NetIC2_14: IC2.14(X1) Q9.2(B)
NetIC2_15: IC2.15(X2) Q10.2(B)
NetQ8_1: Q8.1(C) R1.1 R15.1 R29.1 R43.1 R57.1 R71.1 R85.1
NetQ9_1: Q9.1(C) R3.1 R17.1 R31.1 R45.1 R59.1 R73.1 R87.1
NetQ10_1: Q10.1(C) R5.1 R19.1 R33.1 R47.1 R61.1 R75.1 R89.1
NetQ11_1: Q11.1(C) R7.1 R21.1 R35.1 R49.1 R63.1 R77.1 R91.1
NetQ12_1: Q12.1(C) R9.1 R23.1 R37.1 R51.1 R65.1 R79.1 R93.1
NetQ13_1: Q13.1(C) R11.1 R25.1 R39.1 R53.1 R67.1 R81.1 R95.1
NetQ14_1: Q14.1(C) R13.1 R27.1 R41.1 R55.1 R69.1 R83.1 R97.1
NetR2_2: R2.2 R16.2 R30.2 R44.2 R58.2 R72.2 R86.2 S_IR1.1(1E) S_IR8.1(1E) S_IR15.1(1E) S_IR22.1(1E) S_IR29.1(1E) S_IR36.1(1E) S_IR43.1(1E)
NetR4_2: R4.2 R18.2 R32.2 R46.2 R60.2 R74.2 R88.2 S_IR2.1(1E) S_IR9.1(1E) S_IR16.1(1E) S_IR23.1(1E) S_IR30.1(1E) S_IR37.1(1E) S_IR44.1(1E)
NetR14_2: R14.2 R28.2 R42.2 R56.2 R70.2 R84.2 R98.2 S_IR7.1(1E) S_IR14.1(1E) S_IR21.1(1E) S_IR28.1(1E) S_IR35.1(1E) S_IR42.1(1E) S_IR49.1(1E)

Not connected (* = marked no-connect by the designer): D1 CKI(CI) SDI(DI); D57 CKO(CO) SDO(DO); IC1 3(X) 4(X7) 6(INH) 9(C) 10(B) 11(A); IC2 2(X6) 3(X) 4(X7) 6(INH) 9(C) 10(B) 11(A); IR? 1(A) 2; Q14 2(B)

## Library data of the parts
D1-D64 = APA102-2020: APA102 Addressable RGB LED    Used in manufacturing of various products at SparkFun   Packages: 5050  2020     SparkFun Products: SparkFun Lumenati Boards; PROD_ID: DIO-13883
IC1 IC2 = 4051D: 8-channel ANALOG MULTIPLEXER
IR? = IR26-51C: IR26-51C SMD IR Emitter
Q0-Q6 = MOSFET-P4: P-Channel MOSFET, Externally Terminated Substrate; Published: 24-Mar-1999; LatestRevisionDate: 29-May-2009; LatestRevisionNote: IPC-7351 Footprint Added.; PackageVersion: 2002; PackageReference: SOT223; Publisher: Altium Limited; PackageDescription: 4-Pin SOT-223 Package 2.3 mm Pitch, 7 mm Lead Span; Code_JEITA: SC-75; Code_JEDEC: TO-261-AA-B; Code_IPC: SOT223-4
Q8-Q14 = QNPN: NPN Bipolar Transistor; Published: 8-Jun-2000; LatestRevisionDate: 29-May-2009; LatestRevisionNote: IPC-7351 Footprint Added.; PackageVersion: Aug-1999; PackageReference: SOT-23B; Publisher: Altium Limited; PackageDescription: 3-Pin SOT-23 Package 0.95 mm Pitch, 2.4 mm Lead Span
R1-R98 = Res3: Resistor; Published: 8-Jun-2000; LatestRevisionDate: 29-May-2009; LatestRevisionNote: IPC-7351 Footprint Added.; PackageReference: J1-0603; Publisher: Altium Limited; PackageDescription: Chip Resistor